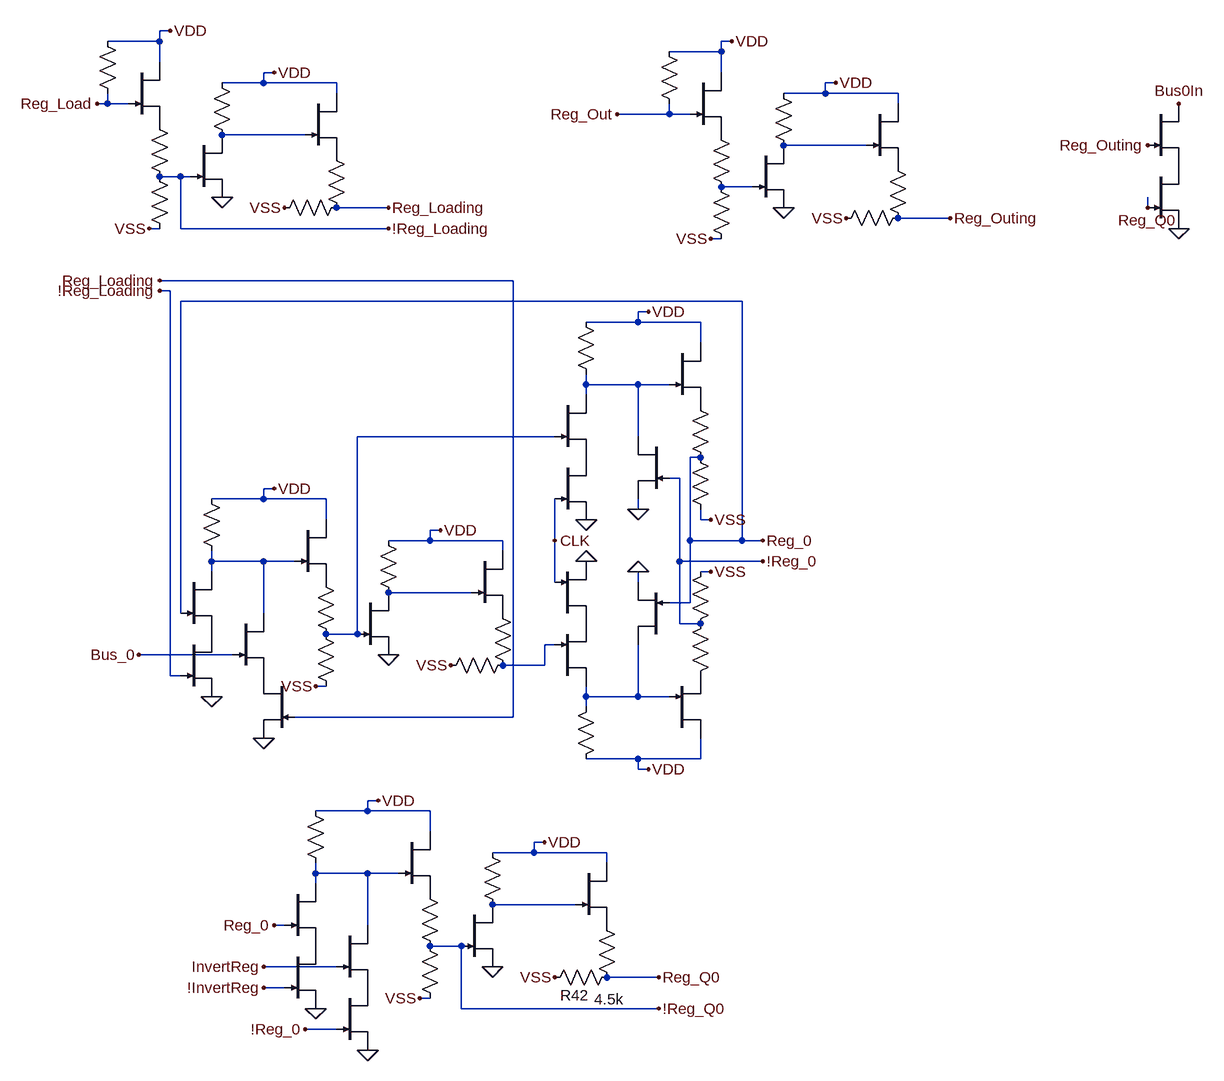
[diagram p0: schematic invertible register 1 bit.asc]
invertible register 1 bit.asc, the LTspice schematic file:
Version 4.1
SHEET 1 109444 42780
WIRE -5680 -1200 -5696 -1200
WIRE -5696 -1184 -5696 -1200
WIRE -5696 -1184 -5776 -1184
WIRE -4816 -1184 -4832 -1184
WIRE -4832 -1168 -4832 -1184
WIRE -4832 -1168 -4912 -1168
WIRE -5696 -1152 -5696 -1184
WIRE -5520 -1136 -5536 -1136
WIRE -4832 -1136 -4832 -1168
WIRE -5536 -1120 -5536 -1136
WIRE -5536 -1120 -5600 -1120
WIRE -5424 -1120 -5536 -1120
WIRE -4656 -1120 -4672 -1120
WIRE -5424 -1104 -5424 -1120
WIRE -4672 -1104 -4672 -1120
WIRE -4672 -1104 -4736 -1104
WIRE -4560 -1104 -4672 -1104
WIRE -5776 -1088 -5776 -1104
WIRE -5776 -1088 -5792 -1088
WIRE -5744 -1088 -5776 -1088
WIRE -4560 -1088 -4560 -1104
WIRE -4912 -1072 -4912 -1088
WIRE -4912 -1072 -4992 -1072
WIRE -4880 -1072 -4912 -1072
WIRE -5472 -1040 -5600 -1040
WIRE -4608 -1024 -4736 -1024
WIRE -5664 -976 -5696 -976
WIRE -5648 -976 -5664 -976
WIRE -4784 -960 -4832 -960
WIRE -5344 -928 -5424 -928
WIRE -4176 -928 -4176 -944
WIRE -4480 -912 -4560 -912
WIRE -5696 -896 -5712 -896
WIRE -5664 -896 -5664 -976
WIRE -5344 -896 -5664 -896
WIRE -4832 -880 -4848 -880
WIRE -5152 -816 -5696 -816
WIRE -5680 -800 -5696 -800
WIRE -4800 -784 -5664 -784
WIRE -4944 -768 -4960 -768
WIRE -4960 -752 -4960 -768
WIRE -4960 -752 -5040 -752
WIRE -4864 -752 -4960 -752
WIRE -4864 -720 -4864 -752
WIRE -5040 -656 -5040 -672
WIRE -4960 -656 -5040 -656
WIRE -4912 -656 -4960 -656
WIRE -5040 -640 -5040 -656
WIRE -5088 -576 -5392 -576
WIRE -4960 -576 -4960 -656
WIRE -4864 -544 -4880 -544
WIRE -4896 -512 -4912 -512
WIRE -5520 -496 -5536 -496
WIRE -5536 -480 -5536 -496
WIRE -5536 -480 -5616 -480
WIRE -5440 -480 -5536 -480
WIRE -4960 -464 -4960 -480
WIRE -5440 -448 -5440 -480
WIRE -4864 -448 -4864 -464
WIRE -4848 -448 -4864 -448
WIRE -5264 -432 -5280 -432
WIRE -5280 -416 -5280 -432
WIRE -5280 -416 -5344 -416
WIRE -5168 -416 -5280 -416
WIRE -5088 -416 -5088 -480
WIRE -4880 -416 -4880 -544
WIRE -4800 -416 -4800 -784
WIRE -4800 -416 -4880 -416
WIRE -4768 -416 -4800 -416
WIRE -5168 -400 -5168 -416
WIRE -5616 -384 -5616 -400
WIRE -5536 -384 -5616 -384
WIRE -5488 -384 -5536 -384
WIRE -4896 -384 -4896 -512
WIRE -4768 -384 -4896 -384
WIRE -5616 -368 -5616 -384
WIRE -4848 -368 -4864 -368
WIRE -5088 -352 -5088 -416
WIRE -4960 -352 -4960 -368
WIRE -5216 -336 -5344 -336
WIRE -4880 -320 -4880 -416
WIRE -4880 -320 -4912 -320
WIRE -5664 -304 -5664 -784
WIRE -5536 -304 -5536 -384
WIRE -4896 -288 -4896 -384
WIRE -4864 -288 -4896 -288
WIRE -5392 -272 -5392 -576
WIRE -5392 -272 -5440 -272
WIRE -5088 -256 -5104 -256
WIRE -5584 -240 -5728 -240
WIRE -5104 -224 -5104 -256
WIRE -5104 -224 -5168 -224
WIRE -5680 -208 -5680 -800
WIRE -5664 -208 -5680 -208
WIRE -5440 -192 -5456 -192
WIRE -5040 -176 -5040 -192
WIRE -4960 -176 -4960 -256
WIRE -4960 -176 -5040 -176
WIRE -4912 -176 -4960 -176
WIRE -5040 -160 -5040 -176
WIRE -5152 -144 -5152 -816
WIRE -5152 -144 -5488 -144
WIRE -4960 -80 -5040 -80
WIRE -4864 -80 -4864 -112
WIRE -4864 -80 -4960 -80
WIRE -4960 -64 -4960 -80
WIRE -4944 -64 -4960 -64
WIRE -5360 -16 -5376 -16
WIRE -5376 0 -5376 -16
WIRE -5376 0 -5456 0
WIRE -5280 0 -5376 0
WIRE -5280 32 -5280 0
WIRE -5104 48 -5120 48
WIRE -5120 64 -5120 48
WIRE -5120 64 -5184 64
WIRE -5008 64 -5120 64
WIRE -5008 80 -5008 64
WIRE -5456 96 -5456 80
WIRE -5376 96 -5456 96
WIRE -5328 96 -5376 96
WIRE -5456 112 -5456 96
WIRE -5056 144 -5184 144
WIRE -5504 176 -5520 176
WIRE -5376 176 -5376 96
WIRE -5232 208 -5280 208
WIRE -5424 240 -5536 240
WIRE -4928 256 -5008 256
WIRE -5504 272 -5536 272
WIRE -5280 288 -5296 288
WIRE -5232 304 -5232 208
WIRE -4928 304 -5232 304
WIRE -5424 336 -5472 336
FLAG -5600 -944 0
FLAG -5680 -1200 VDD
FLAG -5520 -1136 VDD
FLAG -5712 -896 VSS
FLAG -5504 -928 VSS
FLAG -4736 -928 0
FLAG -4816 -1184 VDD
FLAG -4656 -1120 VDD
FLAG -4848 -880 VSS
FLAG -4640 -912 VSS
FLAG -4944 -768 VDD
FLAG -4944 -64 VDD
FLAG -4848 -368 VSS
FLAG -5040 -384 0
FLAG -5040 -448 0
FLAG -4960 -464 0
FLAG -4960 -368 0
FLAG -4848 -448 VSS
FLAG -5088 -416 CLK
FLAG -5536 -112 0
FLAG -5616 -176 0
FLAG -5344 -240 0
FLAG -5520 -496 VDD
FLAG -5264 -432 VDD
FLAG -5456 -192 VSS
FLAG -5248 -224 VSS
FLAG -5696 -816 Reg_Loading
FLAG -5344 -928 Reg_Loading
FLAG -5344 -896 !Reg_Loading
FLAG -5696 -800 !Reg_Loading
FLAG -5792 -1088 Reg_Load
FLAG -4992 -1072 Reg_Out
FLAG -4480 -912 Reg_Outing
FLAG -4128 -896 0
FLAG -4128 -1088 Bus0In
FLAG -4176 -1024 Reg_Outing
FLAG -5376 368 0
FLAG -5456 304 0
FLAG -5184 240 0
FLAG -5360 -16 VDD
FLAG -5104 48 VDD
FLAG -5296 288 VSS
FLAG -5088 256 VSS
FLAG -5536 240 InvertReg
FLAG -5536 272 !InvertReg
FLAG -4176 -928 Reg_Q0
FLAG -5728 -240 Bus_0
FLAG -5520 176 Reg_0
FLAG -5472 336 !Reg_0
FLAG -4928 256 Reg_Q0
FLAG -4928 304 !Reg_Q0
FLAG -4768 -384 !Reg_0
FLAG -4768 -416 Reg_0
SYMBOL res -5792 -1200 R0
WINDOW 0 -35 57 Invisible 2
WINDOW 3 34 56 Invisible 2
SYMATTR InstName R3457
SYMATTR Value 100k
SYMBOL njf -5744 -1152 R0
WINDOW 0 56 32 Invisible 2
WINDOW 3 56 72 Invisible 2
SYMATTR InstName J_F881
SYMATTR Value DR
SYMBOL res -5712 -1072 R0
WINDOW 0 -24 60 Invisible 2
WINDOW 3 34 58 Invisible 2
SYMATTR InstName R3458
SYMATTR Value 1k
SYMBOL res -5712 -992 R0
WINDOW 0 -22 62 Invisible 2
WINDOW 3 37 62 Invisible 2
SYMATTR InstName R3459
SYMATTR Value 4.8k
SYMBOL njf -5648 -1040 R0
WINDOW 0 56 32 Invisible 2
WINDOW 3 56 72 Invisible 2
SYMATTR InstName J_A2131
SYMATTR Value DR
SYMBOL res -5616 -1136 R0
WINDOW 0 56 32 Invisible 2
WINDOW 3 56 72 Invisible 2
SYMATTR InstName R3460
SYMATTR Value 50k
SYMBOL njf -5472 -1104 R0
WINDOW 0 56 32 Invisible 2
WINDOW 3 56 72 Invisible 2
SYMATTR InstName J_A2132
SYMATTR Value DR
SYMBOL res -5440 -1024 R0
WINDOW 0 37 24 Invisible 2
WINDOW 3 -30 25 Invisible 2
SYMATTR InstName R3461
SYMATTR Value 1k
SYMBOL res -5408 -944 R90
WINDOW 0 59 66 Invisible 2
WINDOW 3 34 13 Invisible 2
SYMATTR InstName R3462
SYMATTR Value 4.5k
SYMBOL res -4928 -1184 R0
WINDOW 0 -35 57 Invisible 2
WINDOW 3 34 56 Invisible 2
SYMATTR InstName R3463
SYMATTR Value 100k
SYMBOL njf -4880 -1136 R0
WINDOW 0 56 32 Invisible 2
WINDOW 3 56 72 Invisible 2
SYMATTR InstName J_F882
SYMATTR Value DR
SYMBOL res -4848 -1056 R0
WINDOW 0 -24 60 Invisible 2
WINDOW 3 34 58 Invisible 2
SYMATTR InstName R3464
SYMATTR Value 1k
SYMBOL res -4848 -976 R0
WINDOW 0 -22 62 Invisible 2
WINDOW 3 37 62 Invisible 2
SYMATTR InstName R3465
SYMATTR Value 4.8k
SYMBOL njf -4784 -1024 R0
WINDOW 0 56 32 Invisible 2
WINDOW 3 56 72 Invisible 2
SYMATTR InstName J_A2133
SYMATTR Value DR
SYMBOL res -4752 -1120 R0
WINDOW 0 56 32 Invisible 2
WINDOW 3 56 72 Invisible 2
SYMATTR InstName R3466
SYMATTR Value 50k
SYMBOL njf -4608 -1088 R0
WINDOW 0 56 32 Invisible 2
WINDOW 3 56 72 Invisible 2
SYMATTR InstName J_A2134
SYMATTR Value DR
SYMBOL res -4576 -1008 R0
WINDOW 0 37 24 Invisible 2
WINDOW 3 -30 25 Invisible 2
SYMATTR InstName R3467
SYMATTR Value 1k
SYMBOL res -4544 -928 R90
WINDOW 0 59 66 Invisible 2
WINDOW 3 34 13 Invisible 2
SYMATTR InstName R3468
SYMATTR Value 4.5k
SYMBOL njf -5088 -640 R0
WINDOW 0 56 32 Invisible 2
WINDOW 3 56 72 Invisible 2
SYMATTR InstName J_A2135
SYMATTR Value DR
SYMBOL res -5056 -768 R0
WINDOW 0 -35 57 Invisible 2
WINDOW 3 34 56 Invisible 2
SYMATTR InstName R3469
SYMATTR Value 100k
SYMBOL njf -4912 -720 R0
WINDOW 0 56 32 Invisible 2
WINDOW 3 56 72 Invisible 2
SYMATTR InstName J_F883
SYMATTR Value DR
SYMBOL res -4880 -640 R0
WINDOW 0 -24 60 Invisible 2
WINDOW 3 34 58 Invisible 2
SYMATTR InstName R3470
SYMATTR Value 1k
SYMBOL res -4880 -560 R0
WINDOW 0 -22 62 Invisible 2
WINDOW 3 37 62 Invisible 2
SYMATTR InstName R3471
SYMATTR Value 4.8k
SYMBOL njf -4912 -576 M0
WINDOW 0 11 -7 Invisible 2
WINDOW 3 56 72 Invisible 2
SYMATTR InstName J_B1002
SYMATTR Value DR
SYMBOL njf -5088 -192 M180
WINDOW 0 56 32 Invisible 2
WINDOW 3 56 72 Invisible 2
SYMATTR InstName J_A2136
SYMATTR Value DR
SYMBOL res -5056 -64 M180
WINDOW 0 36 76 Invisible 2
WINDOW 3 36 40 Invisible 2
SYMATTR InstName R3472
SYMATTR Value 100k
SYMBOL njf -4912 -112 M180
WINDOW 0 56 32 Invisible 2
WINDOW 3 56 72 Invisible 2
SYMATTR InstName J_F884
SYMATTR Value DR
SYMBOL res -4880 -192 M180
WINDOW 0 36 76 Invisible 2
WINDOW 3 36 40 Invisible 2
SYMATTR InstName R3473
SYMATTR Value 1k
SYMBOL res -4880 -272 M180
WINDOW 0 36 76 Invisible 2
WINDOW 3 36 40 Invisible 2
SYMATTR InstName R3474
SYMATTR Value 4.8k
SYMBOL njf -4912 -256 R180
WINDOW 0 56 32 Invisible 2
WINDOW 3 56 72 Invisible 2
SYMATTR InstName J_B1003
SYMATTR Value DR
SYMBOL njf -5088 -544 R0
WINDOW 0 56 32 Invisible 2
WINDOW 3 56 72 Invisible 2
SYMATTR InstName J_A2137
SYMATTR Value DR
SYMBOL njf -5088 -288 M180
WINDOW 0 56 32 Invisible 2
WINDOW 3 56 72 Invisible 2
SYMATTR InstName J_A2138
SYMATTR Value DR
SYMBOL njf -5664 -368 R0
WINDOW 0 56 32 Invisible 2
WINDOW 3 56 72 Invisible 2
SYMATTR InstName J_A2139
SYMATTR Value DR
SYMBOL res -5632 -496 R0
WINDOW 0 -35 57 Invisible 2
WINDOW 3 34 56 Invisible 2
SYMATTR InstName R3475
SYMATTR Value 100k
SYMBOL njf -5488 -448 R0
WINDOW 0 56 32 Invisible 2
WINDOW 3 56 72 Invisible 2
SYMATTR InstName J_F885
SYMATTR Value DR
SYMBOL res -5456 -368 R0
WINDOW 0 -24 60 Invisible 2
WINDOW 3 34 58 Invisible 2
SYMATTR InstName R3476
SYMATTR Value 1k
SYMBOL res -5456 -288 R0
WINDOW 0 -22 62 Invisible 2
WINDOW 3 37 62 Invisible 2
SYMATTR InstName R3477
SYMATTR Value 4.8k
SYMBOL njf -5584 -304 R0
WINDOW 0 56 32 Invisible 2
WINDOW 3 56 72 Invisible 2
SYMATTR InstName J_B1004
SYMATTR Value DR
SYMBOL njf -5392 -336 R0
WINDOW 0 56 32 Invisible 2
WINDOW 3 56 72 Invisible 2
SYMATTR InstName J_A2140
SYMATTR Value DR
SYMBOL res -5360 -432 R0
WINDOW 0 56 32 Invisible 2
WINDOW 3 56 72 Invisible 2
SYMATTR InstName R3478
SYMATTR Value 50k
SYMBOL njf -5216 -400 R0
WINDOW 0 56 32 Invisible 2
WINDOW 3 56 72 Invisible 2
SYMATTR InstName J_A2141
SYMATTR Value DR
SYMBOL res -5184 -320 R0
WINDOW 0 37 24 Invisible 2
WINDOW 3 -30 25 Invisible 2
SYMATTR InstName R3479
SYMATTR Value 1k
SYMBOL res -5152 -240 R90
WINDOW 0 59 66 Invisible 2
WINDOW 3 34 13 Invisible 2
SYMATTR InstName R3480
SYMATTR Value 4.5k
SYMBOL njf -5664 -272 R0
WINDOW 0 56 32 Invisible 2
WINDOW 3 56 72 Invisible 2
SYMATTR InstName J_A2142
SYMATTR Value DR
SYMBOL njf -5488 -208 M0
WINDOW 0 56 32 Invisible 2
WINDOW 3 56 72 Invisible 2
SYMATTR InstName J_B1005
SYMATTR Value DR
SYMBOL njf -4176 -992 R0
WINDOW 0 56 32 Invisible 2
WINDOW 3 56 72 Invisible 2
SYMATTR InstName J_A23
SYMATTR Value DR
SYMBOL njf -4176 -1088 R0
WINDOW 0 56 32 Invisible 2
WINDOW 3 56 72 Invisible 2
SYMATTR InstName J_A24
SYMATTR Value DR
SYMBOL njf -5504 112 R0
WINDOW 0 56 32 Invisible 2
WINDOW 3 56 72 Invisible 2
SYMATTR InstName J_A31
SYMATTR Value DR
SYMBOL res -5472 -16 R0
WINDOW 0 -35 57 Invisible 2
WINDOW 3 34 56 Invisible 2
SYMATTR InstName R37
SYMATTR Value 100k
SYMBOL njf -5328 32 R0
WINDOW 0 56 32 Invisible 2
WINDOW 3 56 72 Invisible 2
SYMATTR InstName J_F9
SYMATTR Value DR
SYMBOL res -5296 112 R0
WINDOW 0 -24 60 Invisible 2
WINDOW 3 34 58 Invisible 2
SYMATTR InstName R38
SYMATTR Value 1k
SYMBOL res -5296 192 R0
WINDOW 0 -31 62 Invisible 2
WINDOW 3 37 62 Invisible 2
SYMATTR InstName R39
SYMATTR Value 4.8k
SYMBOL njf -5424 176 R0
WINDOW 0 56 32 Invisible 2
WINDOW 3 56 72 Invisible 2
SYMATTR InstName J_B13
SYMATTR Value DR
SYMBOL njf -5232 144 R0
WINDOW 0 56 32 Invisible 2
WINDOW 3 56 72 Invisible 2
SYMATTR InstName J_A32
SYMATTR Value DR
SYMBOL res -5200 48 R0
WINDOW 0 56 32 Invisible 2
WINDOW 3 56 72 Invisible 2
SYMATTR InstName R40
SYMATTR Value 50k
SYMBOL njf -5056 80 R0
WINDOW 0 56 32 Invisible 2
WINDOW 3 56 72 Invisible 2
SYMATTR InstName J_A33
SYMATTR Value DR
SYMBOL res -5024 160 R0
WINDOW 0 37 24 Invisible 2
WINDOW 3 -30 25 Invisible 2
SYMATTR InstName R41
SYMATTR Value 1k
SYMBOL res -4992 240 R90
WINDOW 0 59 66 VBottom 2
WINDOW 3 34 13 VTop 2
SYMATTR InstName R42
SYMATTR Value 4.5k
SYMBOL njf -5504 208 R0
WINDOW 0 57 49 Invisible 2
WINDOW 3 56 72 Invisible 2
SYMATTR InstName J_A34
SYMATTR Value DR
SYMBOL njf -5424 272 R0
WINDOW 0 56 32 Invisible 2
WINDOW 3 56 72 Invisible 2
SYMATTR InstName J_B14
SYMATTR Value DR

The netlist it stands for:
* invertible register 1 bit.asc
R3457 VDD Reg_Load 100k
J_F881 VDD Reg_Load P001 DR
R3458 P001 !Reg_Loading 1k
R3459 !Reg_Loading VSS 4.8k
J_A2131 N001 !Reg_Loading 0 DR
R3460 VDD N001 50k
J_A2132 VDD N001 P002 DR
R3461 P002 Reg_Loading 1k
R3462 Reg_Loading VSS 4.5k
R3463 VDD Reg_Out 100k
J_F882 VDD Reg_Out P003 DR
R3464 P003 N003 1k
R3465 N003 VSS 4.8k
J_A2133 N002 N003 0 DR
R3466 VDD N002 50k
J_A2134 VDD N002 P004 DR
R3467 P004 Reg_Outing 1k
R3468 Reg_Outing VSS 4.5k
J_A2135 N004 N005 P005 DR
R3469 VDD N004 100k
J_F883 VDD N004 P006 DR
R3470 P006 Reg_0 1k
R3471 Reg_0 VSS 4.8k
J_B1002 N004 !Reg_0 0 DR
J_A2136 N009 N008 P007 DR
R3472 VDD N009 100k
J_F884 VDD N009 P008 DR
R3473 P008 !Reg_0 1k
R3474 !Reg_0 VSS 4.8k
J_B1003 N009 Reg_0 0 DR
J_A2137 P005 CLK 0 DR
J_A2138 P007 CLK 0 DR
J_A2139 N006 Reg_0 P009 DR
R3475 VDD N006 100k
J_F885 VDD N006 P010 DR
R3476 P010 N005 1k
R3477 N005 VSS 4.8k
J_B1004 N006 Bus_0 P011 DR
J_A2140 N007 N005 0 DR
R3478 VDD N007 50k
J_A2141 VDD N007 P012 DR
R3479 P012 N008 1k
R3480 N008 VSS 4.5k
J_A2142 P009 !Reg_Loading 0 DR
J_B1005 P011 Reg_Loading 0 DR
J_A23 P013 Reg_Q0 0 DR
J_A24 Bus0In Reg_Outing P013 DR
J_A31 N010 Reg_0 P014 DR
R37 VDD N010 100k
J_F9 VDD N010 P015 DR
R38 P015 !Reg_Q0 1k
R39 !Reg_Q0 VSS 4.8k
J_B13 N010 InvertReg P016 DR
J_A32 N011 !Reg_Q0 0 DR
R40 VDD N011 50k
J_A33 VDD N011 P017 DR
R41 P017 Reg_Q0 1k
R42 Reg_Q0 VSS 4.5k
J_A34 P014 !InvertReg 0 DR
J_B14 P016 !Reg_0 0 DR
.model NJF NJF
.model PJF PJF
.lib standard.jft
.backanno
.end